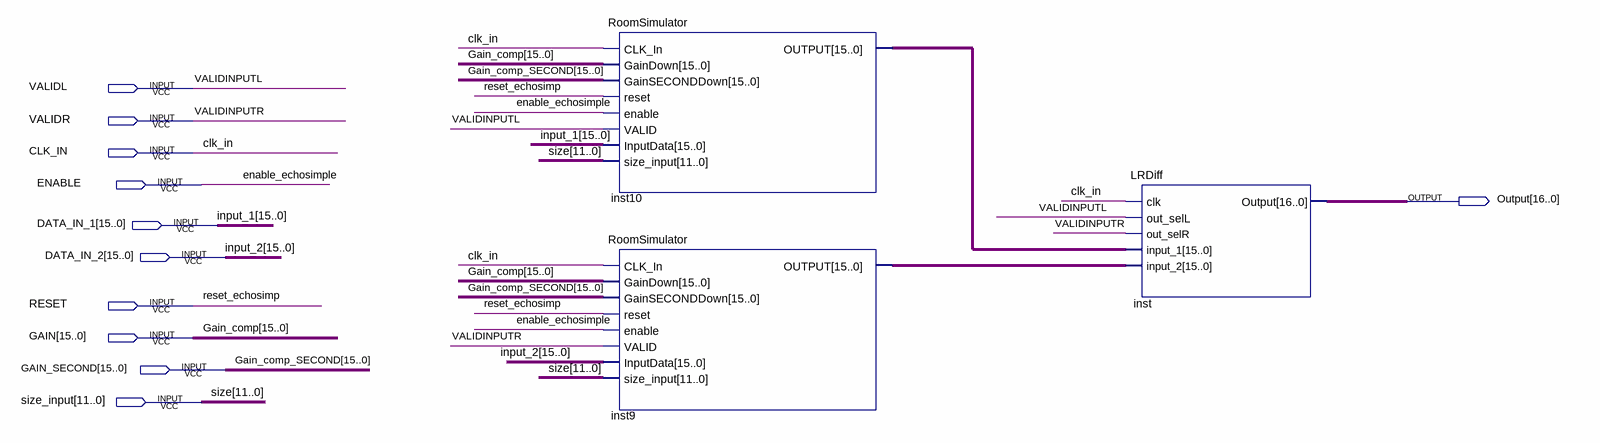
[diagram p0: schematic sheet]
// Quartus schematic RoomSimlatorBlock.bdf as structural Verilog: 3 symbols, 11 pins
module RoomSimlatorBlock (
  input  VALIDL,
  input  VALIDR,
  input  CLK_IN,
  input  ENABLE,
  input  [15:0] DATA_IN_1,
  input  [15:0] DATA_IN_2,
  input  RESET,
  input  [15:0] GAIN,
  input  [15:0] GAIN_SECOND,
  input  [11:0] size_input,
  output [16:0] Output
);

  wire [15:0] inst9_output, inst10_output;

  RoomSimulator inst10 (
    .CLK_In(CLK_IN), .GainDown(GAIN), .GainSECONDDown(GAIN_SECOND), .reset(RESET), .enable(ENABLE),
    .VALID(VALIDL), .InputData(DATA_IN_1), .size_input(size_input), .OUTPUT(inst10_output));
  RoomSimulator inst9 (
    .CLK_In(CLK_IN), .GainDown(GAIN), .GainSECONDDown(GAIN_SECOND), .reset(RESET), .enable(ENABLE),
    .VALID(VALIDR), .InputData(DATA_IN_2), .size_input(size_input), .OUTPUT(inst9_output));
  LRDiff inst (
    .clk(CLK_IN), .out_selL(VALIDL), .out_selR(VALIDR), .input_1(inst10_output), .input_2(inst9_output),
    .Output(Output));

  // Other names for the same wires on the sheet: enable_echosimple = ENABLE; Gain_comp[15:0] = GAIN;
  //   Gain_comp_SECOND[15:0] = GAIN_SECOND; input_1[15:0] = DATA_IN_1; input_2[15:0] = DATA_IN_2;
  //   reset_echosimp = RESET; size[11:0] = size_input; VALIDINPUTL = VALIDL; VALIDINPUTR = VALIDR
endmodule
